# Altium schematic sheet FRONT-UNIT.SCHDOC: FRONT-UNIT
size A2; DocumentNumber: 2; Revision: 1.8.2; SheetNumber: 2; SheetTotal: 19; DocumentName: Лист 1.SCHDOC
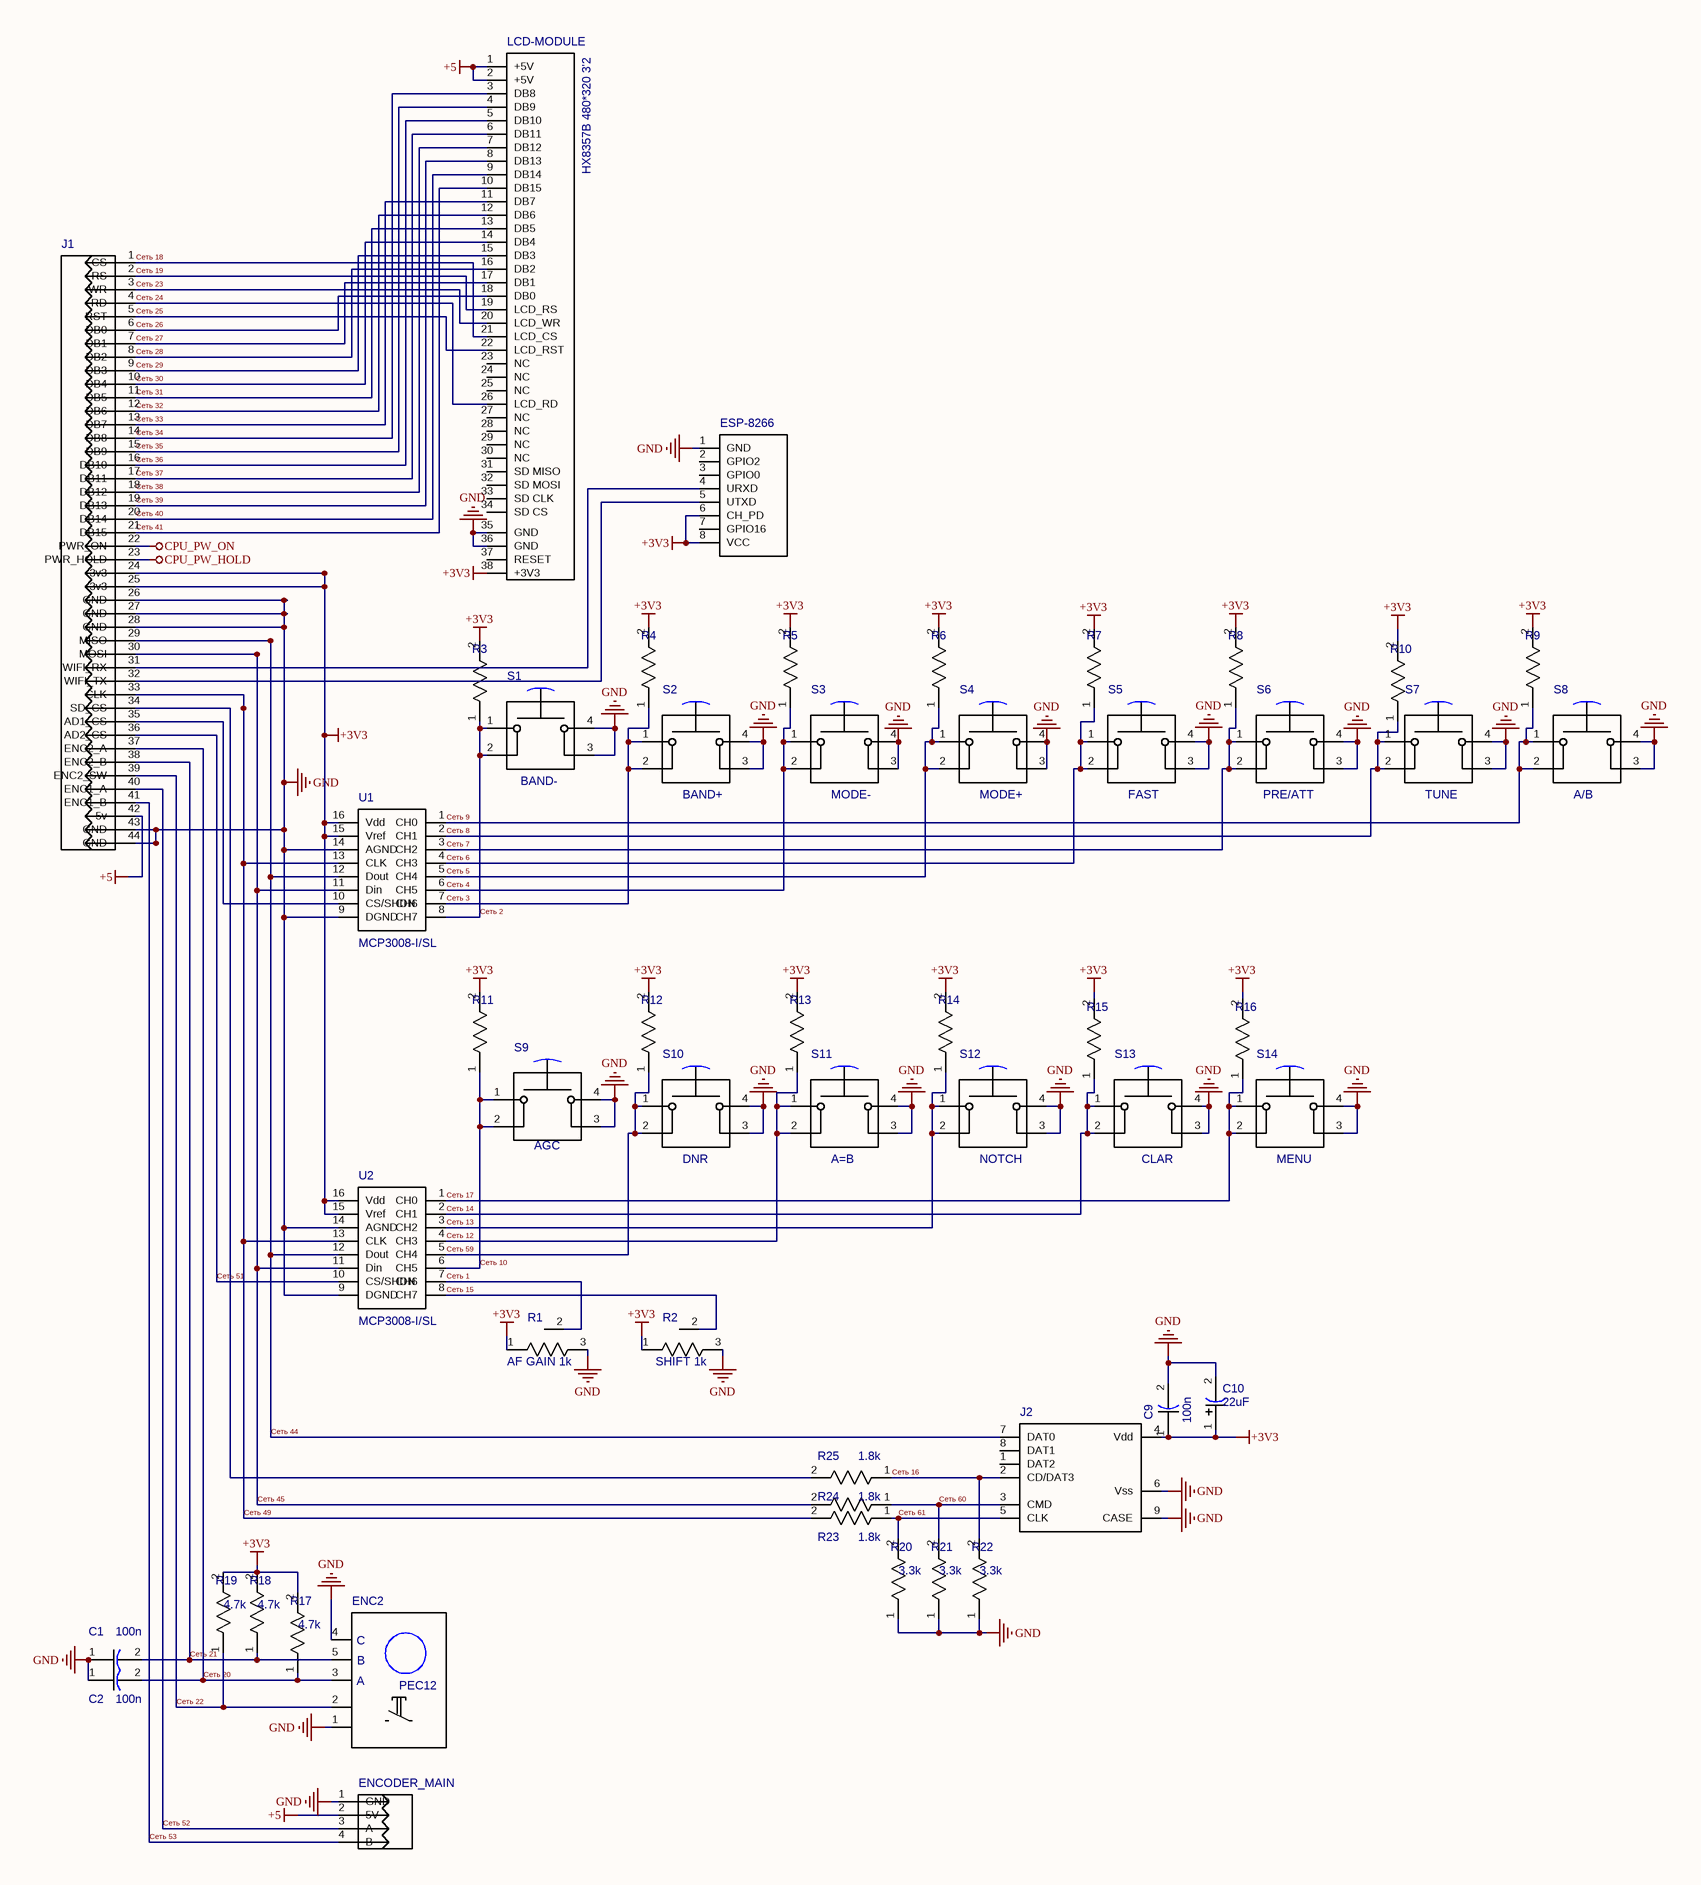
[diagram p0: FRONT-UNIT.SCHDOC, left]
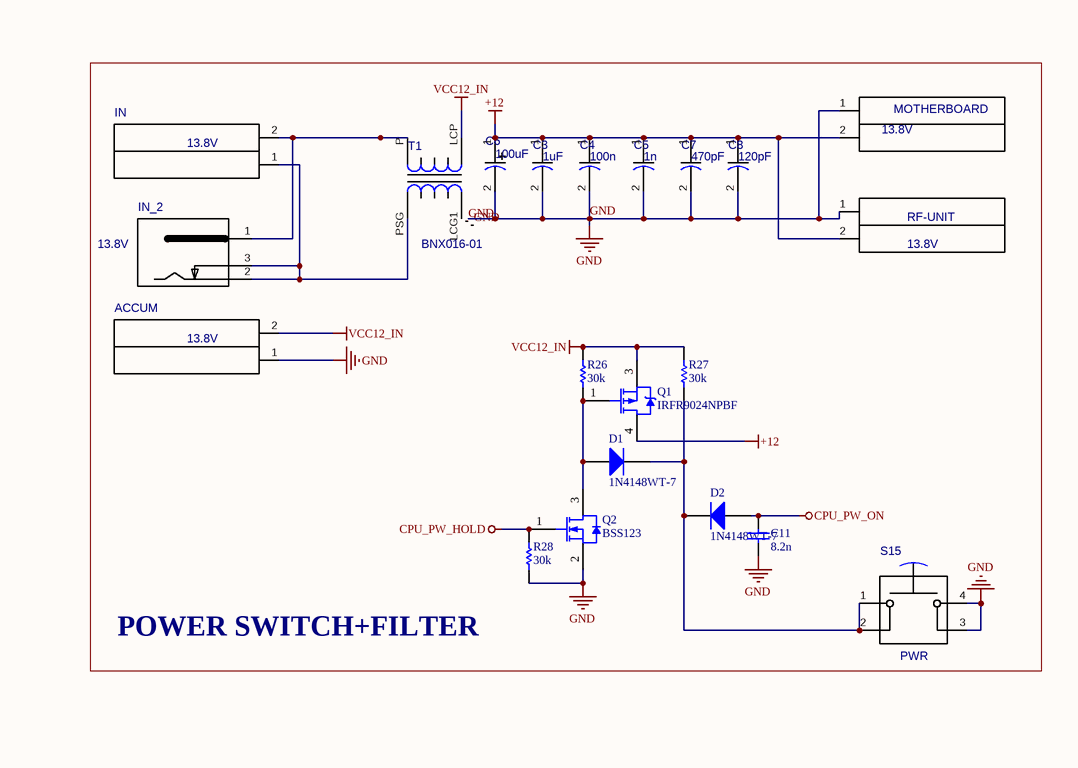
[diagram p1: FRONT-UNIT.SCHDOC, right]

## Parts
ACCUM  value 13.8V  [JX2]  (hidden comment: JX2)
C1  value 100n  [CAP_0805]  (hidden comment: CAP_0805)
C2  value 100n  [CAP_0805]  (hidden comment: CAP_0805)
C3  value 1uF  [CAP_1206]  (hidden comment: CAP_1206)
C4  value 100n  [CAP_1206]  (hidden comment: CAP_1206)
C5  value 1n  [CAP_1206]  (hidden comment: CAP_1206)
C6  value 100uF  [CAP250RP]  (hidden comment: CAP250RP)
C7  value 470pF  [CAP_1206]  (hidden comment: CAP_1206)
C8  value 120pF  [CAP_1206]  (hidden comment: CAP_1206)
C9  value 100n  [CAP_0805]  (hidden comment: CAP_0805)
C10  value 22uF  [EEEFC_sizeB]  (hidden comment: EEEFC_sizeB)
C11  8.2n  [CAPC2013X94X50LL20T25]
D1  1N4148WT-7  [DIOD-SOD523-2_V]
D2  1N4148WT-7  [DIOD-SOD523-2_V]
ENC2  PEC12  [PEC12]
ENCODER_MAIN  644456-4  [644456-4]  (value not drawn)
ESP-8266  ESP-01 ESP8266  [ESP-01 ESP8266]  (value not drawn)
IN  value 13.8V  [JX2]  (hidden comment: JX2)
IN_2  value 13.8V  [PJ-050B]  (hidden comment: PJ-050B)
J1  90131-0142  [90131-0142]  (value not drawn)
J2  0472190001  [0472190001]  (value not drawn)
LCD-MODULE  value HX8357B 480*320 3'2  [LCD-MODULE-3.2-480-320]  (hidden comment: LCD-MODULE_3'2_480х320)
MOTHERBOARD  value 13.8V  [JX2]  (hidden comment: JX2)
Q1  IRFR9024NPBF  [ONSC-DPAK-3-369C-01_V]
Q2  BSS123  [FAIR-SOT23-3_V]
R1  value AF GAIN 1k  [PTV09]  (hidden comment: AF GAIN)
R2  value SHIFT 1k  [PTV09]  (hidden comment: SHIFT)
R3  RES_0805  [RES_0805]  (value not drawn)
R4  RES_0805  [RES_0805]  (value not drawn)
R5  RES_0805  [RES_0805]  (value not drawn)
R6  RES_0805  [RES_0805]  (value not drawn)
R7  RES_0805  [RES_0805]  (value not drawn)
R8  RES_0805  [RES_0805]  (value not drawn)
R9  RES_0805  [RES_0805]  (value not drawn)
R10  RES_0805  [RES_0805]  (value not drawn)
R11  RES_0805  [RES_0805]  (value not drawn)
R12  RES_0805  [RES_0805]  (value not drawn)
R13  RES_0805  [RES_0805]  (value not drawn)
R14  RES_0805  [RES_0805]  (value not drawn)
R15  RES_0805  [RES_0805]  (value not drawn)
R16  RES_0805  [RES_0805]  (value not drawn)
R17  value 4.7k  [RES_0805]  (hidden comment: RES_0805)
R18  value 4.7k  [RES_0805]  (hidden comment: RES_0805)
R19  value 4.7k  [RES_0805]  (hidden comment: RES_0805)
R20  value 3.3k  [RES_0805]  (hidden comment: RES_0805)
R21  value 3.3k  [RES_0805]  (hidden comment: RES_0805)
R22  value 3.3k  [RES_0805]  (hidden comment: RES_0805)
R23  value 1.8k  [RES_0805]  (hidden comment: RES_0805)
R24  value 1.8k  [RES_0805]  (hidden comment: RES_0805)
R25  value 1.8k  [RES_0805]  (hidden comment: RES_0805)
R26  30k  [RESC2013X60X40NL20T25]
R27  30k  [RESC2013X60X40NL20T25]
R28  30k  [RESC2013X60X40NL20T25]
RF-UNIT  value 13.8V  [JX2]  (hidden comment: JX2)
S1  BAND-  [PTS645SK50LFS]
S2  BAND+  [PTS645SK50LFS]
S3  MODE-  [PTS645SK50LFS]
S4  MODE+  [PTS645SK50LFS]
S5  FAST  [PTS645SK50LFS]
S6  PRE/ATT  [PTS645SK50LFS]
S7  TUNE  [PTS645SK50LFS]
S8  A/B  [PTS645SK50LFS]
S9  AGC  [PTS645SK50LFS]
S10  DNR  [PTS645SK50LFS]
S11  value A=B  [PTS645SK50LFS]  (hidden comment: NOTCH)
S12  NOTCH  [PTS645SK50LFS]
S13  CLAR  [PTS645SK50LFS]
S14  MENU  [PTS645SK50LFS]
S15  PWR  [PTS645SK50LFS]
T1  value BNX016-01  [TRANSF_ICORE]  (hidden comment: TRANSF_ICORE)
U1  MCP3008-I/SL  [MCP3008-I/SL]
U2  MCP3008-I/SL  [MCP3008-I/SL]

## Blocks framed on the sheet
POWER SWITCH+FILTER: ACCUM C3-C8 C11 D1 D2 IN IN_2 MOTHERBOARD Q1 Q2 R26-R28 RF-UNIT S15 T1

## Nets
+3V3: C9.1 C10.1(PLUS) ESP-8266.6(CH_PD) ESP-8266.8(VCC) J1.24(3v3) J1.25(3v3) J2.4(Vdd) LCD-MODULE.38(+3V3) R1.1(CW) R2.1(CW) R3.2 R4.2 R5.2 R6.2 R7.2 R8.2 R9.2 R10.2 R11.2 R12.2 R13.2 R14.2 R15.2 R16.2 R17.2 R18.2 R19.2 U1.15(Vref) U1.16(Vdd) U2.15(Vref) U2.16(Vdd)
+5: ENCODER_MAIN.2(5V) J1.42(5v) LCD-MODULE.1(+5V) LCD-MODULE.2(+5V)
+12: C3.1 C4.1 C5.1 C6.1(PLUS) C7.1 C8.1 MOTHERBOARD.2 Q1.4(D) RF-UNIT.2
CPU_PW_HOLD: J1.23(PWR_HOLD) Q2.1(G) R28.2
CPU_PW_ON: C11.2 D2.2(A) J1.22(PWR_ON)
GND: ACCUM.1 C1.1 C2.1 C3.2 C4.2 C5.2 C6.2(MINUS) C7.2 C8.2 C9.2 C10.2(MINUS) C11.1 ENC2.1 ENC2.4(C) ENCODER_MAIN.1(GND) ESP-8266.1(GND) J1.26(GND) J1.27(GND) J1.28(GND) J1.43(GND) J1.44(GND) J2.6(Vss) J2.9(CASE) LCD-MODULE.35(GND) LCD-MODULE.36(GND) MOTHERBOARD.1 Q2.2(S) R1.3(CCW) R2.3(CCW) R20.1 R21.1 R22.1 R28.1 RF-UNIT.1 S1.3(B) S1.4(B) S2.3(B) S2.4(B) S3.3(B) S3.4(B) S4.3(B) S4.4(B) S5.3(B) S5.4(B) S6.3(B) S6.4(B) S7.3(B) S7.4(B) S8.3(B) S8.4(B) S9.3(B) S9.4(B) S10.3(B) S10.4(B) S11.3(B) S11.4(B) S12.3(B) S12.4(B) S13.3(B) S13.4(B) S14.3(B) S14.4(B) S15.3(B) S15.4(B) T1.LCG2 T1.LCG3 U1.9(DGND) U1.14(AGND) U2.9(DGND) U2.14(AGND)
VCC12_IN: ACCUM.2 Q1.3(S) R26.2 R27.2 T1.LCP(P2)
Сеть 1: R1.2(W) U2.7(CH6)
Сеть 2: R3.1 S1.1(A) S1.2(A) U1.8(CH7)
Сеть 3: R4.1 S2.1(A) S2.2(A) U1.7(CH6)
Сеть 4: R5.1 S3.1(A) S3.2(A) U1.6(CH5)
Сеть 5: R6.1 S4.1(A) S4.2(A) U1.5(CH4)
Сеть 6: R7.1 S5.1(A) S5.2(A) U1.4(CH3)
Сеть 7: R8.1 S6.1(A) S6.2(A) U1.3(CH2)
Сеть 8: R10.1 S7.1(A) S7.2(A) U1.2(CH1)
Сеть 9: R9.1 S8.1(A) S8.2(A) U1.1(CH0)
Сеть 10: R11.1 S9.1(A) S9.2(A) U2.6(CH5)
Сеть 12: R13.1 S11.1(A) S11.2(A) U2.4(CH3)
Сеть 13: R14.1 S12.1(A) S12.2(A) U2.3(CH2)
Сеть 14: R15.1 S13.1(A) S13.2(A) U2.2(CH1)
Сеть 15: R2.2(W) U2.8(CH7)
Сеть 16: J2.2(CD/DAT3) R22.2 R25.1
Сеть 17: R16.1 S14.1(A) S14.2(A) U2.1(CH0)
Сеть 18: J1.1(CS) LCD-MODULE.21(LCD_CS)
Сеть 19: J1.2(RS) LCD-MODULE.19(LCD_RS)
Сеть 20: C2.2 ENC2.3(A) J1.37(ENC2_A) R17.1
Сеть 21: C1.2 ENC2.5(B) J1.38(ENC2_B) R18.1
Сеть 22: ENC2.2 J1.39(ENC2_SW) R19.1
Сеть 23: J1.3(WR) LCD-MODULE.20(LCD_WR)
Сеть 24: J1.4(RD) LCD-MODULE.26(LCD_RD)
Сеть 25: J1.5(RST) LCD-MODULE.22(LCD_RST)
Сеть 26: J1.6(DB0) LCD-MODULE.18(DB0)
Сеть 27: J1.7(DB1) LCD-MODULE.17(DB1)
Сеть 28: J1.8(DB2) LCD-MODULE.16(DB2)
Сеть 29: J1.9(DB3) LCD-MODULE.15(DB3)
Сеть 30: J1.10(DB4) LCD-MODULE.14(DB4)
Сеть 31: J1.11(DB5) LCD-MODULE.13(DB5)
Сеть 32: J1.12(DB6) LCD-MODULE.12(DB6)
Сеть 33: J1.13(DB7) LCD-MODULE.11(DB7)
Сеть 34: J1.14(DB8) LCD-MODULE.3(DB8)
Сеть 35: J1.15(DB9) LCD-MODULE.4(DB9)
Сеть 36: J1.16(DB10) LCD-MODULE.5(DB10)
Сеть 37: J1.17(DB11) LCD-MODULE.6(DB11)
Сеть 38: J1.18(DB12) LCD-MODULE.7(DB12)
Сеть 39: J1.19(DB13) LCD-MODULE.8(DB13)
Сеть 40: J1.20(DB14) LCD-MODULE.9(DB14)
Сеть 41: J1.21(DB15) LCD-MODULE.10(DB15)
Сеть 44: J1.29(MISO) J2.7(DAT0) U1.12(Dout) U2.12(Dout)
Сеть 45: J1.30(MOSI) R24.2 U1.11(Din) U2.11(Din)
Сеть 49: J1.33(CLK) R23.2 U1.13(CLK) U2.13(CLK)
Сеть 51: J1.36(AD2_CS) U2.10(CS/SHDN)
Сеть 52: ENCODER_MAIN.3(A) J1.40(ENC1_A)
Сеть 53: ENCODER_MAIN.4(B) J1.41(ENC1_B)
Сеть 59: R12.1 S10.1(A) S10.2(A) U2.5(CH4)
Сеть 60: J2.3(CMD) R21.2 R24.1
Сеть 61: J2.5(CLK) R20.2 R23.1
NetD1_1: D1.1(K) D2.1(K) R27.1 S15.1(A) S15.2(A)
NetD1_2: D1.2(A) Q1.1(G) Q2.3(D) R26.1
NetESP-8266_4: ESP-8266.4(URXD) J1.31(WIFI_RX)
NetESP-8266_5: ESP-8266.5(UTXD) J1.32(WIFI_TX)
NetIN_1: IN.1 IN_2.2 IN_2.3 T1.PSG(S1)
NetIN_2: IN.2 IN_2.1 T1.P(P1)
NetJ1_34: J1.34(SD_CS) R25.2
NetJ1_35: J1.35(AD1_CS) U1.10(CS/SHDN)

Not connected (* = marked no-connect by the designer): ESP-8266 2(GPIO2) 3(GPIO0) 7(GPIO16); J2 1(DAT2) 8(DAT1); LCD-MODULE 23(NC) 24(NC) 25(NC) 27(NC) 28(NC) 29(NC) 30(NC) 31(SD_MISO) 32(SD_MOSI) 33(SD_CLK) 34(SD_CS) 37(RESET); T1 LCG1(S2)

## Notes on the sheet
- Title
- Size:
- Date:
- File:
- A2
- Number:
- Time:
- Revision:
- Sheet
- of

## Library data of the parts
C11 = CMP-2007-04444-1: Manufacturer: AVX Interconnect / Elco; Part Number: 08055C822KAT2A
D1 D2 = CMP-2000-05518-1: Surface Mount Fast Switching Diode, -65 to 150 degC, 2-Pin SOD523, RoHS, Tape and Reel; Manufacturer: Diodes Inc; Forward Current: 250mA; Diode Configuration: Single; Number of Elements per Chip: 1; Datasheet URL: http://www.diodes.com/_files/datasheets/ds30396.pdf; Pin Count: 2; PartNumber: 1N4148WT; Mounting Type: SurfaceMount; Package Description: 2-Pin Small Outline Diode, Body 1.2 x 0.8 mm; Package URL: http://www.diodes.com/_files/packages/SOD523.pdf; Package Type: SOD-523; Manufacturer URL: http://www.diodes.com/; Datasheet Version: Rev. 16-2, 11/2015; Package Reference: SOD523-2; Mounting Technology: SurfaceMount
ENC2 = PEC12: FULLNAME: Выключатель замыкающий с приводом нажатием кнопки; Value: PEC12
J2 = 0472190001: Value: MicroSD
Q1 = CMP-1058-00387-1: IRFR9024NPBF, Транзистор, Р-канал 55В 11А; Manufacturer: On Semiconductor; PartNumber: NTD2955G; Ciss Typ (pF): 500; Qrr Typ (nC): 100; VGS Max (V): 20; PD Max (W): 55; Channel Polarity: P Channel; V(BR)DSS Min (V): 60; ID Max (A): 12; Configuration: Single; Crss Typ (pF): 50; Packing: Tape and Reel; VGS(th) Max (V): 4; Coss Typ (pF): 150; RoHS: Pb-Free; ComponentLink1Description: Manufacturer URL; Mounting Technology: Surface Mount; ComponentLink2URL: http://www.onsemi.cn/pub_link/Collateral/NTD2955-D.PDF; PackageDescription: 3-Pin Flange Mount, Body 6.54 x 6.095 mm, Pitch 2.29 mm; ComponentLink3Description: Package Specification; Package Type: DPAK-3, IPAK-4; ComponentLink3URL: http://www.onsemi.cn/pub_link/Collateral/369C.PDF; DatasheetVersion: Rev. 13; ComponentLink2Description: Datasheet; ComponentLink1URL: http://www.onsemi.com/; PackageVersion: Rev. E, 02/2014; PackageReference: DPAK-3-369C-01
Q2 = CMP-2000-04934-1: N-Channel Logic Level Enhancement Mode Field Effect Transistor, 1.7 V, -55 to 150 degC, 3-Pin SOT-23, RoHS, Tape and Reel; Manufacturer: Fairchild; Channel Type: N; Typical Turn-Off Delay Time: 17ns; Maximum Continuous Drain Current: 0.17A; Rad Hard: No; Typical Rise Time: 9ns; Typical Fall Time: 2.4ns; Maximum Gate Source Voltage: ±20V; Maximum Drain Source Voltage: 100V; Typical Turn-On Delay Time: 1.7ns; RDS-on: 6000@10VmOhm; Package Version: Rev. 12, 03/2016; Packaging: Tape&Reel; Package Reference: SOT23-3; Channel Mode: Enhancement; Operating Temperature: -55to150degC; Package Description: 3-Pin Small Outline Transistor, Body 2.92 x 1.325 mm, Pitch 0.95 mm; Category: MOSFET; Datasheet Version: Jun-03; Datasheet URL: https://www.fairchildsemi.com/datasheets/BS/BSS123.pdf; Manufacturer URL: https://www.fairchildsemi.com/; Mounting: SurfaceMount; Package: 3SOT-23; Package URL: http://www.fairchildsemi.com/dwg/MA/MA03D.pdf
R1 R2 = PTV09: Adjustable Resistor PTV09
R3-R16 = RES_0805: Value: 4.7k
R26-R28 = CMP-2001-00626-1: Manufacturer: Panasonic; Part Number: ERA-6AEB303V
S1-S15 = PTS645SK50LFS
  S1: Value: BAND-
  S2: Value: BAND+
  S3: Value: MODE-
  S4: Value: MODE+
  S5: Value: FAST
  S6: Value: PRE/ATT
  S7: Value: TUNE
  S8: Value: A/B
  S9: Value: AGC
  S10: Value: DNR
  S12: Value: NOTCH
  S13: Value: CLAR
  S14: Value: MENU
  S15: Value: PWR
T1 = TRANSF_ICORE: Transformer
ESP-8266 = ESP-01 ESP8266: Value: ESP-01 ESP8266
U1 U2 = MCP3008-I/SL: Value: MCP3008-I/SL